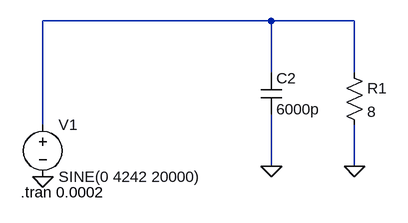
[diagram p0: schematic Draft2.asc]
Draft2.asc, the LTspice schematic file:
Version 4
SHEET 1 880 680
WIRE 400 -48 48 -48
WIRE 528 -48 400 -48
WIRE 400 32 400 -48
WIRE 528 32 528 -48
WIRE 48 112 48 -48
WIRE 400 176 400 96
WIRE 528 176 528 112
FLAG 528 176 0
FLAG 48 192 0
FLAG 400 176 0
SYMBOL voltage 48 96 R0
WINDOW 123 0 0 Left 0
WINDOW 39 0 0 Left 0
SYMATTR InstName V1
SYMATTR Value SINE(0 4242 20000)
SYMBOL res 512 16 R0
SYMATTR InstName R1
SYMATTR Value 8
SYMBOL cap 384 32 R0
SYMATTR InstName C2
SYMATTR Value 6000p
TEXT 14 216 Left 2 !.tran 0.0002

The netlist it stands for:
* Draft2.asc
V1 N001 0 SINE(0 4242 20000)
R1 N001 0 8
C2 N001 0 6000p
.tran 0.0002
.backanno
.end

* Results of the author's LTspice run, read from the files saved beside the schematic
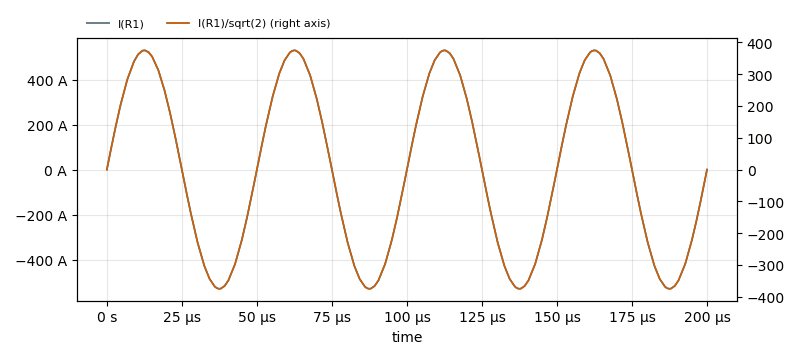
[diagram p1: Transient Analysis of Draft2.asc, plotted from the saved traces]
* Transient Analysis, 1 run:
*   I(R1): min -530.1 A, max 530.1 A, average -1.114 mA, rms 374.9 A, last 0 A
*   I(R1)/sqrt(2): min -374.8 , max 374.8 , average -787.7 µ, rms 265.1 , last 0